# EAGLE design PIC18F66J60-1 (EAGLE 6.2)
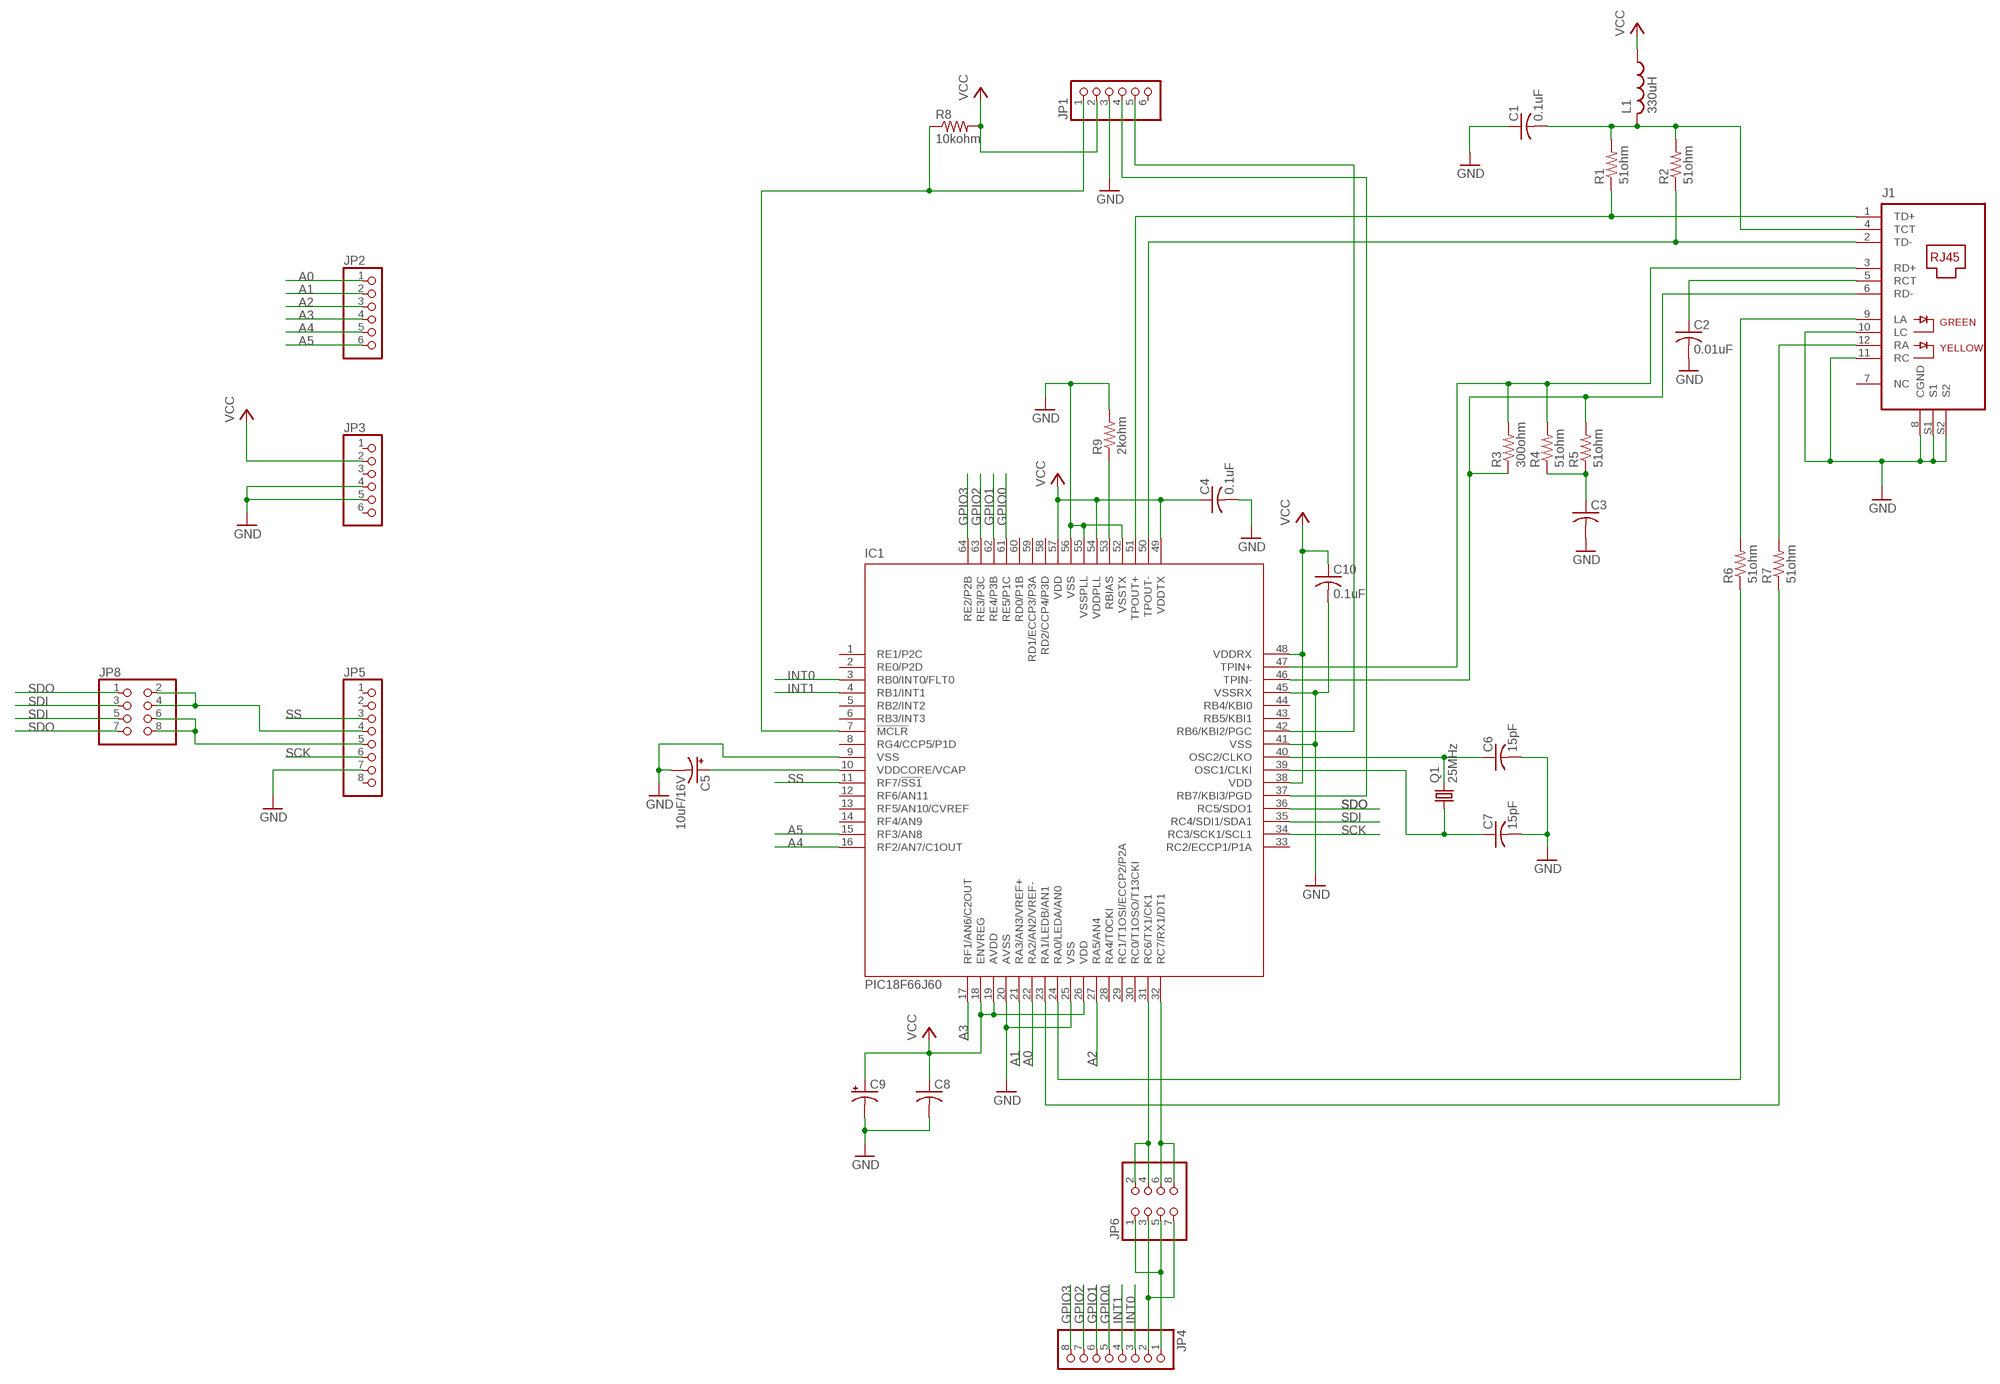
[diagram p0: schematic, sheet 1]

## Parts
C1  0.1uF  C-US025-040X050  [C025-040X050]
C2  0.01uF  C-US025-040X050  [C025-040X050]
C3  C-US025-040X050  [C025-040X050]
C4  0.1uF  C-US025-040X050  [C025-040X050]
C5  10uF/16V  CPOL-USE2.5-7  [E2,5-7]
C6  15pF  C-US025-040X050  [C025-040X050]
C7  15pF  C-US025-040X050  [C025-040X050]
C8  C-US025-040X050  [C025-040X050]
C9  CPOL-USE2.5-7  [E2,5-7]
C10  0.1uF  C-US025-040X050  [C025-040X050]
IC1  PIC18F66J60  [TQFP64-10X10]
J1  J0011  [PJ-J0]
JP1  PINHD-1X6  [1X06]
JP2  PINHD-1X6  [1X06]
JP3  PINHD-1X6  [1X06]
JP4  PINHD-1X8  [1X08]
JP5  PINHD-1X8  [1X08]
JP6  PINHD-2X4  [2X04]
JP8  PINHD-2X4  [2X04]
L1  330uH  L-US-01  [0204V]
Q1  25MHz  CRYSTALHC49S  [HC49/S]
R1  51ohm  R-US-01  [0204V]
R2  51ohm  R-US-01  [0204V]
R3  300ohm  R-US-01  [0204V]
R4  51ohm  R-US-01  [0204V]
R5  51ohm  R-US-01  [0204V]
R6  51ohm  R-US-01  [0204V]
R7  51ohm  R-US-01  [0204V]
R8  10kohm  R-US-01  [0204V]
R9  2kohm  R-US-01  [0204V]

## Nets
A0: IC1.22(RA2/AN2/VREF-) JP2.1
A1: IC1.21(RA3/AN3/VREF+) JP2.2
A2: IC1.27(RA5/AN4) JP2.3
A3: IC1.17(RF1/AN6/C2OUT) JP2.4
A4: IC1.16(RF2/AN7/C1OUT) JP2.5
A5: IC1.15(RF3/AN8) JP2.6
GND: C1.1 C2.2 C3.2 C4.2 C5.- C6.2 C7.2 C8.2 C9.- C10.2 IC1.9(VSS) IC1.20(AVSS) IC1.25(VSS) IC1.41(VSS) IC1.45(VSSRX) IC1.52(VSSTX) IC1.55(VSSPLL) IC1.56(VSS) J1.8(CGND) J1.10(LC) J1.11(RC) J1.S1 J1.S2 JP1.3 JP3.4 JP3.5 JP5.7 R9.2
GPIO0: IC1.61(RE5/P1C) JP4.5
GPIO1: IC1.62(RE4/P3B) JP4.6
GPIO2: IC1.63(RE3/P3C) JP4.7
GPIO3: IC1.64(RE2/P2B) JP4.8
INT0: IC1.3(RB0/INT0/FLT0) JP4.3
INT1: IC1.4(RB1/INT1) JP4.4
N$1: IC1.51(TPOUT+) J1.1(TD+) R1.1
N$2: IC1.50(TPOUT-) J1.2(TD-) R2.1
N$3: C1.2 J1.4(TCT) L1.2 R1.2 R2.2
N$4: IC1.47(TPIN+) J1.3(RD+) R3.2 R4.2
N$5: IC1.46(TPIN-) J1.6(RD-) R3.1 R5.2
N$6: C2.1 J1.5(RCT)
N$7: C3.1 R4.1 R5.1
N$8: J1.9(LA) R6.2
N$9: J1.12(RA) R7.2
N$10: IC1.37(RB7/KBI3/PGD) JP1.4
N$11: IC1.7(!MCLR) JP1.1 R8.1
N$12: IC1.24(RA0/LEDA/AN0) R6.1
N$13: IC1.23(RA1/LEDB/AN1) R7.1
N$14: IC1.42(RB6/KBI2/PGC) JP1.5
N$15: C6.1 IC1.40(OSC2/CLKO) Q1.2
N$16: C7.1 IC1.39(OSC1/CLKI) Q1.1
N$17: IC1.31(RC6/TX1/CK1) JP6.2 JP6.4
N$18: IC1.53(RBIAS) R9.1
N$19: C5.+ IC1.10(VDDCORE/VCAP)
N$20: IC1.32(RC7/RX1/DT1) JP6.6 JP6.8
N$21: JP5.5 JP8.6 JP8.8
N$22: JP4.2 JP6.3 JP6.7
N$23: JP4.1 JP6.1 JP6.5
N$25: JP5.4 JP8.2 JP8.4
SCK: IC1.34(RC3/SCK1/SCL1) JP5.6
SDI: IC1.35(RC4/SDI1/SDA1) JP8.3 JP8.5
SDO: IC1.36(RC5/SDO1) JP8.1 JP8.7
SS: IC1.11(RF7/!SS1) JP5.3
VCC: C4.1 C8.1 C9.+ C10.1 IC1.18(ENVREG) IC1.19(AVDD) IC1.26(VDD) IC1.38(VDD) IC1.48(VDDRX) IC1.49(VDDTX) IC1.54(VDDPLL) IC1.57(VDD) JP1.2 JP3.2 L1.1 R8.2
Unconnected: IC1.1(RE1/P2C) IC1.2(RE0/P2D) IC1.5(RB2/INT2) IC1.6(RB3/INT3) IC1.8(RG4/CCP5/P1D) IC1.12(RF6/AN11) IC1.13(RF5/AN10/CVREF) IC1.14(RF4/AN9) IC1.28(RA4/T0CKI) IC1.29(RC1/T1OSI/ECCP2/P2A) IC1.30(RC0/T1OSO/T13CKI) IC1.33(RC2/ECCP1/P1A) IC1.43(RB5/KBI1) IC1.44(RB4/KBI0) IC1.58(RD2/CCP4/P3D) IC1.59(RD1/ECCP3/P3A) IC1.60(RD0/P1B) J1.7(NC) JP1.6 JP3.1 JP3.3 JP3.6 JP5.1 JP5.2 JP5.8

## Library data of the parts
C1-C4 C6-C8 C10 = rcl:C-US: CAPACITOR, American symbol
C5 C9 = rcl:CPOL-US: POLARIZED CAPACITOR, American symbol
IC1 = microchip:PIC18F6*J6: PIC18F97J60 Family 64/80/100-Pin High-Performance, 1-Mbit Flash Microcontrollers with Ethernet Source: http://ww1.microchip.com/downloads/en/DeviceDoc/39762d.pdf; MPN: PIC18F66J60-I/PT; OC_FARNELL: 1332282; OC_NEWARK: 56K7296
J1 = pulse_j0011:J0011: RJ45 PulseJack w/LEDs
JP1-JP3 = pinhead:PINHD-1X6: PIN HEADER
JP4 JP5 = pinhead:PINHD-1X8: PIN HEADER
JP6 JP8 = pinhead:PINHD-2X4: PIN HEADER
L1 = kimai0827:L-US-01
Q1 = crystal:CRYSTAL: CRYSTAL; OC_FARNELL: 1667008; OC_NEWARK: unknown
R1-R9 = kimai0827:R-US-01

## Net classes
1 VCC: width 0.61 mm, drill 0.406 mm
2 GND: width 0.813 mm, drill 0.406 mm

## Board
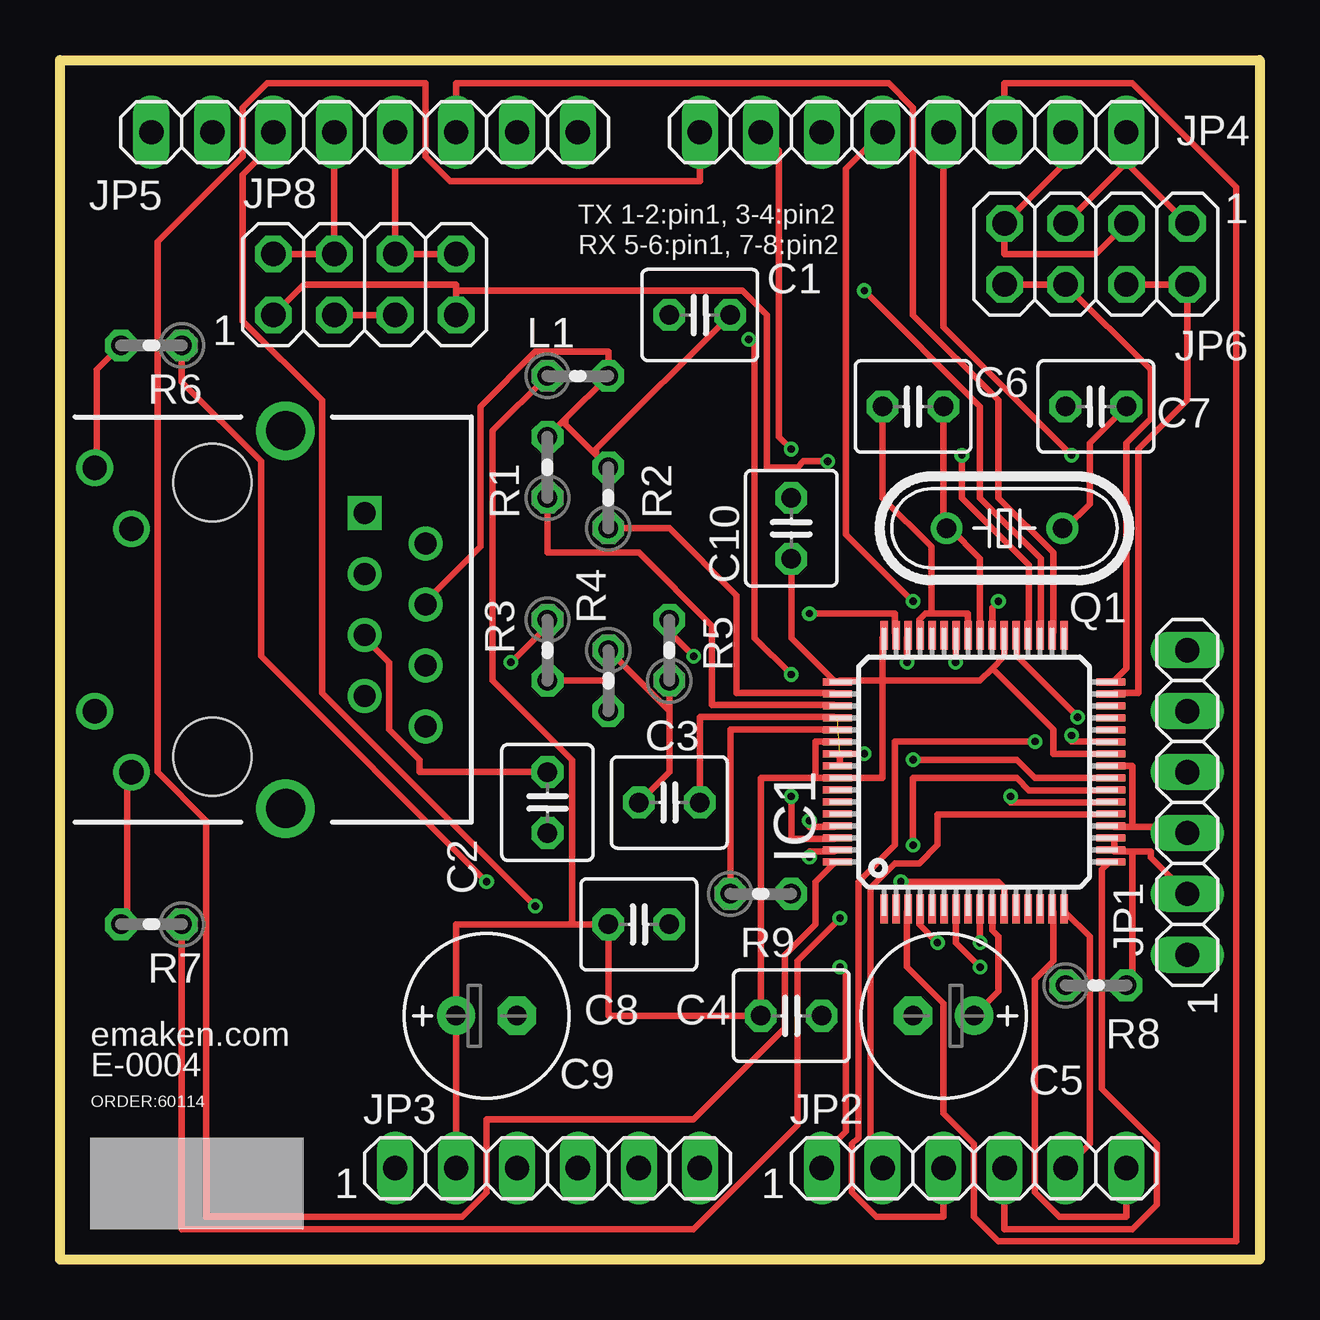
[diagram p1: board, top side]
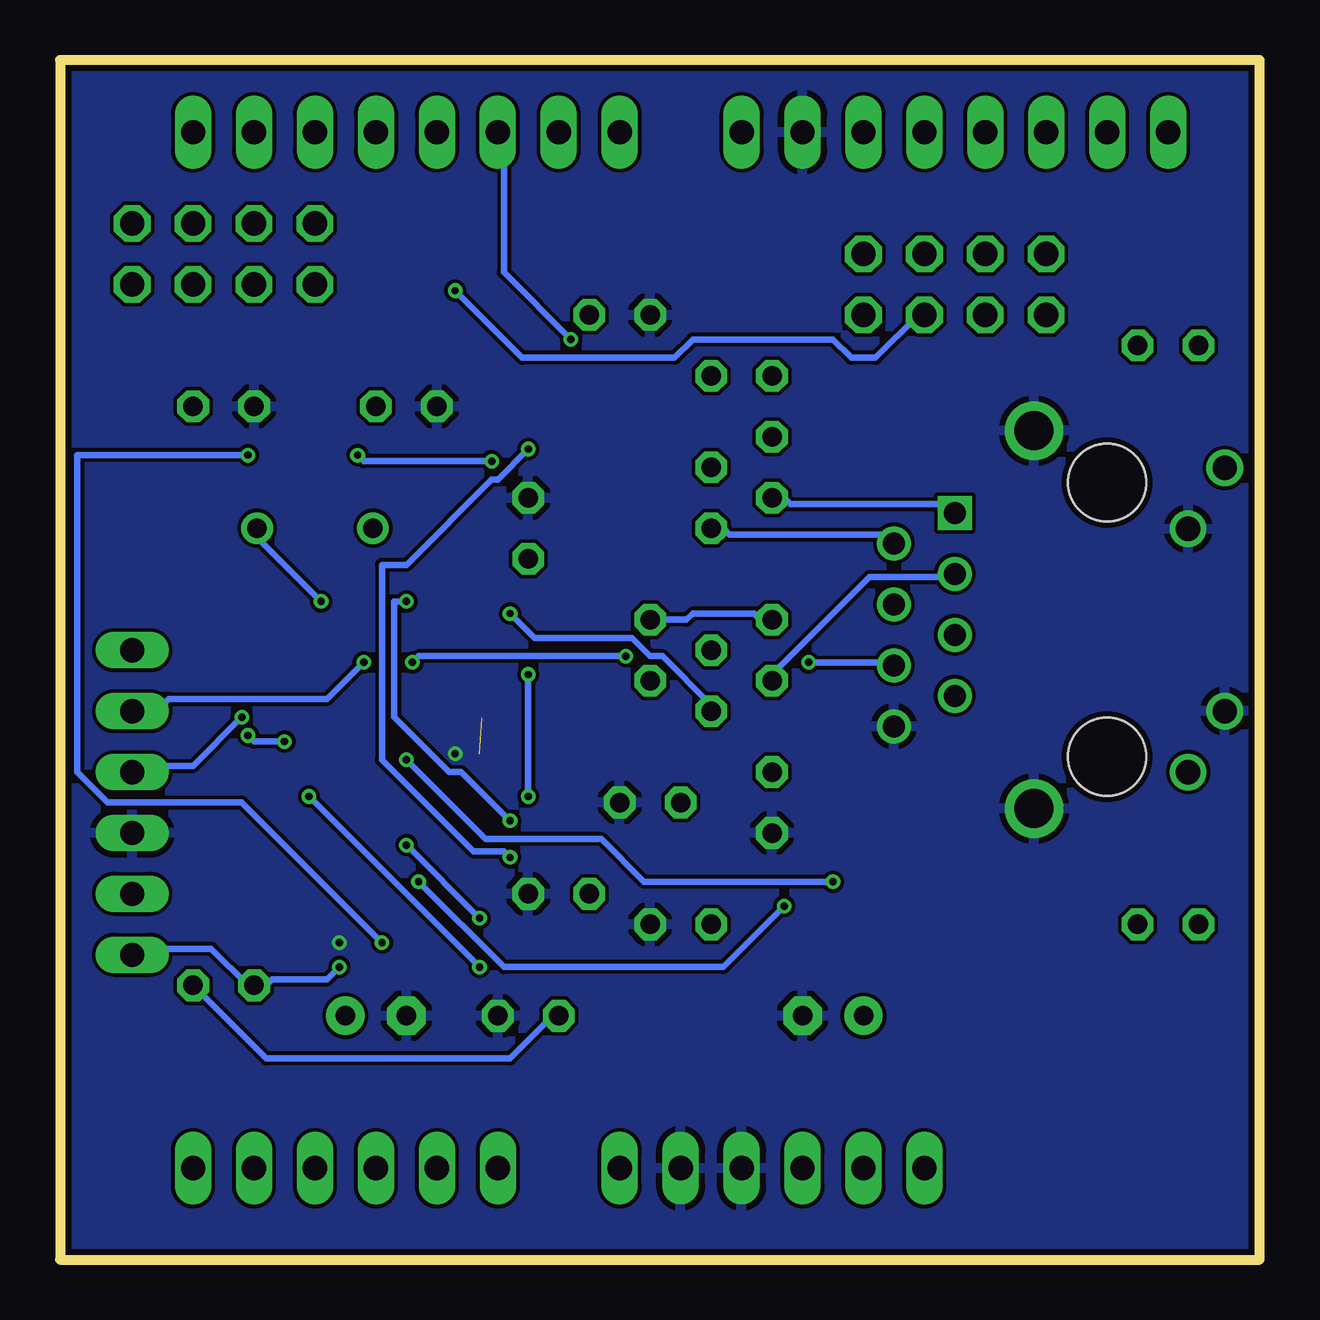
[diagram p2: board, bottom side, seen from below]

Size 50 x 50 mm. Coordinates in mm from the lower left corner, seen from the top.
Outline: 0,50 50,50 50,0 0,0 0,50
Copper layers (1*16): Top 0.035mm / dielectric 1.5mm / Bottom 0.035mm
Design rules: minimum track width 11mil, minimum drill 12mil, track to track 6mil, track to pad 6mil, pad to pad 6mil, via to via 6mil, smd to smd 0mil, copper to edge 10mil, drill to drill 10mil, minimum pad ring 10mil, minimum via ring 6mil, stop-mask expansion 2mil, vias tented up to drill 100mil, thermal gap 10mil

### Footprints (pad centres in the part's own frame; a part is rotated, then mirrored left to right if it is on the bottom)
C025-040X050 = drill 0.813 octagon: 1 -1.27,0; 2 1.27,0
E2,5-7 = drill 0.813 pad 1.6: + -1.27,0 | drill 0.813 pad 1.6 octagon: - 1.27,0
TQFP64-10X10 = smd 1.2 x 0.3: 1 -5.7,3.75; 2 -5.7,3.25; 3 -5.7,2.75; 4 -5.7,2.25; 5 -5.7,1.75; 6 -5.7,1.25; 7 -5.7,0.75; 8 -5.7,0.25; 9 -5.7,-0.25; 10 -5.7,-0.75; 11 -5.7,-1.25; 12 -5.7,-1.75; 13 -5.7,-2.25; 14 -5.7,-2.75; 15 -5.7,-3.25; 16 -5.7,-3.75; 33 5.7,-3.75; 34 5.7,-3.25; 35 5.7,-2.75; 36 5.7,-2.25; 37 5.7,-1.75; 38 5.7,-1.25; 39 5.7,-0.75; 40 5.7,-0.25; 41 5.7,0.25; 42 5.7,0.75; 43 5.7,1.25; 44 5.7,1.75; 45 5.7,2.25; 46 5.7,2.75; 47 5.7,3.25; 48 5.7,3.75 | smd 0.3 x 1.2: 17 -3.75,-5.7; 18 -3.25,-5.7; 19 -2.75,-5.7; 20 -2.25,-5.7; 21 -1.75,-5.7; 22 -1.25,-5.7; 23 -0.75,-5.7; 24 -0.25,-5.7; 25 0.25,-5.7; 26 0.75,-5.7; 27 1.25,-5.7; 28 1.75,-5.7; 29 2.25,-5.7; 30 2.75,-5.7; 31 3.25,-5.7; 32 3.75,-5.7; 49 3.75,5.7; 50 3.25,5.7; 51 2.75,5.7; 52 2.25,5.7; 53 1.75,5.7; 54 1.25,5.7; 55 0.75,5.7; 56 0.25,5.7; 57 -0.25,5.7; 58 -0.75,5.7; 59 -1.25,5.7; 60 -1.75,5.7; 61 -2.25,5.7; 62 -2.75,5.7; 63 -3.25,5.7; 64 -3.75,5.7
PJ-J0 = drill 0.914 square: 1 4.445,-6.35 | drill 0.914: 2 3.175,-8.89; 3 1.905,-6.35; 4 0.635,-8.89; 5 -0.635,-6.35; 6 -1.905,-8.89; 7 -3.175,-6.35; 8 -4.445,-8.89 | drill 1.016: 9 6.325,4.902; 10 3.785,3.378; 11 -3.81,4.902; 12 -6.35,3.378 | drill 1.626: S1 -7.874,-3.048; S2 7.874,-3.048 | hole 3.251: -5.715,0; 5.715,0
1X06 = drill 1.016 long: 1 -6.35,0; 2 -3.81,0; 3 -1.27,0; 4 1.27,0; 5 3.81,0; 6 6.35,0
1X08 = drill 1.016 long: 1 -8.89,0; 2 -6.35,0; 3 -3.81,0; 4 -1.27,0; 5 1.27,0; 6 3.81,0; 7 6.35,0; 8 8.89,0
2X04 = drill 1.016 octagon: 1 -3.81,-1.27; 2 -3.81,1.27; 3 -1.27,-1.27; 4 -1.27,1.27; 5 1.27,-1.27; 6 1.27,1.27; 7 3.81,-1.27; 8 3.81,1.27
0204V = drill 0.813 octagon: 1 0,0; 2 2.54,0
HC49/S = drill 0.813: 1 -2.413,0; 2 2.413,0

### Placement (x,y rotation side)
C1  26.67,39.37 0 top
C2  20.32,19.05 270 top
C3  25.4,19.05 0 top
C4  30.48,10.16 0 top
C5  36.83,10.16 180 top
C6  35.56,35.56 180 top
C7  43.18,35.56 180 top
C8  24.13,13.97 0 top
C9  17.78,10.16 0 top
C10  30.48,30.48 90 top
IC1  38.1,20.32 90 top
J1  6.35,26.67 90 top
JP1  46.99,19.05 90 top
JP2  38.1,3.81 0 top
JP3  20.32,3.81 0 top
JP4  35.56,46.99 180 top
JP5  12.7,46.99 0 top
JP6  43.18,41.91 180 top
JP8  12.7,40.64 0 top
L1  20.32,36.83 0 top
Q1  39.37,30.48 180 top
R1  20.32,31.75 90 top
R2  22.86,30.48 90 top
R3  20.32,26.67 270 top
R4  22.86,25.4 270 top
R5  25.4,24.13 90 top
R6  5.08,38.1 180 top
R7  5.08,13.97 180 top
R8  41.91,11.43 0 top
R9  27.94,15.24 0 top

### Tracks (layer width: path | path; a pad name or v marks a point on that pad's centre or on a via)
A0  (via drill 0.3)
  Top 0.279: v39.62,19.3 39.62,19.05 43.69,19.05 IC1.22 | v32.51,12.19 32.77,11.94 32.77,5.33 31.75,4.32 JP2.1
  Bottom 0.279: v32.51,12.19 v39.62,19.3
A1
  Top 0.279: JP2.2 33.78,4.32 33.78,15.49 34.8,16.51 35.81,16.51 36.58,17.27 36.58,18.54 43.69,18.54 IC1.21
A2  (via drill 0.3)
  Top 0.279: v42.16,21.84 42.16,21.59 43.69,21.59 IC1.27 | v40.64,21.59 34.8,21.59 34.8,17.27 33.27,15.75 33.27,5.08 33.02,4.83 33.02,2.79 34.04,1.78 36.83,1.78 JP2.3
  Bottom 0.279: v42.16,21.84 41.91,21.59 v40.64,21.59
A3
  Top 0.279: JP2.4 39.37,1.27 44.7,1.27 45.72,2.29 45.72,4.83 43.43,7.11 43.43,16.26 43.69,16.51 IC1.17
A4
  Top 0.279: JP2.5 42.93,4.83 42.93,13.46 41.91,14.48 IC1.16
A5
  Top 0.279: JP2.6 44.45,1.78 41.66,1.78 40.64,2.79 40.64,11.68 41.4,12.45 41.4,14.48 IC1.15
GND  (via drill 0.3)  (1 unrouted)
  Top 0.279: 36.32,26.92 37.85,26.92 37.85,26.16 IC1.41 | 36.32,26.92 36.07,26.92 35.81,26.67 35.81,26.16 IC1.45 | 32.51,21.08 32.51,20.57 IC1.56 | v38.35,13.21 38.35,14.48 IC1.9 | 44.7,18.03 46.99,18.03 JP1.3 | 44.7,18.03 43.94,18.03 IC1.20 | 44.7,18.03 44.7,20.57 43.94,20.57 IC1.25 | C3.2 26.67,22.61 32.26,22.61 IC1.52 | v33.53,21.08 32.51,21.08 | 32.51,21.08 IC1.55 | 36.32,26.92 36.32,29.72 34.29,31.75 C6.2
  pour Bottom: -1.27,50.8 50.8,50.8 50.8,-1.27 -1.27,-1.27
GPIO0  (via drill 0.3)
  Top 0.279: v31.24,18.29 31.24,18.03 32.26,18.03 IC1.61 | v35.56,27.43 32.77,30.23 32.77,45.47 JP4.5
  Bottom 0.279: v31.24,18.29 33.27,20.32 33.78,20.32 36.07,22.61 36.07,27.43 v35.56,27.43
GPIO1  (via drill 0.3)
  Top 0.279: v30.48,19.3 30.48,17.53 32.26,17.53 IC1.62 | v30.48,24.38 28.96,25.91 28.96,38.1 v28.7,38.35
  Bottom 0.279: v30.48,24.38 v30.48,19.3 | v28.7,38.35 31.5,41.15 31.5,46.99 JP4.6
GPIO2  (via drill 0.3)
  Top 0.279: v31.24,16.76 31.24,17.02 32.26,17.02 IC1.63 | v30.48,33.78 29.97,34.29 29.97,46.23 JP4.7
  Bottom 0.279: v31.24,16.76 31.5,17.02 32.77,17.02 36.58,20.83 36.58,28.96 35.56,28.96 32,32.51 31.75,32.51 v30.48,33.78
GPIO3
  Top 0.279: JP4.8 26.67,44.96 16.26,44.96 15.24,45.97 15.24,49.02 8.64,49.02 7.62,48.01 7.62,45.97 4.06,42.42 4.06,20.32 6.1,18.29 6.1,1.78 16.76,1.78 17.78,2.79 17.78,5.84 26.42,5.84 30.23,9.65 30.23,12.7 31.5,13.97 31.5,15.75 32.26,16.51 IC1.64
INT0
  Top 0.279: JP4.3 39.37,49.02 44.7,49.02 49.02,44.7 49.02,0.76 39.12,0.76 38.1,1.78 38.1,4.83 36.83,6.1 36.83,10.67 35.31,12.19 35.31,14.48 IC1.3
INT1  (via drill 0.3)
  Top 0.279: v36.58,13.21 35.81,13.97 35.81,14.48 IC1.4 | v42.16,33.53 36.83,38.86 JP4.4
  Bottom 0.279: v36.58,13.21 42.42,19.05 48.01,19.05 49.28,20.32 49.28,33.53 v42.16,33.53
N$1
  Top 0.279: R1.1 20.32,29.46 24.13,29.46 27.18,26.42 27.18,23.11 32.26,23.11 IC1.51
  Bottom 0.279: R1.1 19.81,31.75 19.56,31.5 12.95,31.5 12.7,31.24 J1.1
N$2
  Top 0.279: R2.1 25.4,30.48 28.19,27.69 28.19,23.62 32.26,23.62 IC1.50
  Bottom 0.279: R2.1 22.35,30.48 22.1,30.23 15.49,30.23 15.24,29.97 J1.2
N$3
  Top 0.279: 21.08,35.05 L1.2 22.86,37.85 19.81,37.85 17.53,35.56 17.53,29.72 15.24,27.43 J1.4 | 21.08,35.05 R1.2 | 22.35,33.53 21.08,34.8 21.08,35.05 | 22.35,33.53 R2.2 | C1.2 22.35,33.78 22.35,33.53
N$4  (via drill 0.3)
  Top 0.279: v31.24,26.92 34.8,26.92 34.8,26.16 IC1.47 | R3.2 22.86,24.13 R4.2
  Bottom 0.279: v31.24,26.92 30.23,25.91 26.16,25.91 25.4,25.15 24.89,25.15 22.86,23.11 R4.2 | R3.2 20.32,24.38 16.26,28.45 12.7,28.45 J1.3
N$5  (via drill 0.3)
  Top 0.279: v35.31,24.89 35.31,25.91 IC1.46 | v26.42,25.15 25.4,26.16 R5.2 | v18.8,24.89 20.32,26.42 R3.1
  Bottom 0.279: R5.2 23.88,26.67 23.62,26.92 21.08,26.92 20.83,26.67 R3.1 | v35.31,24.89 35.05,25.15 v26.42,25.15 | v18.8,24.89 15.24,24.89 J1.6
N$6
  Top 0.279: C2.1 14.99,20.32 14.99,20.83 13.72,22.1 13.72,24.89 12.7,25.91 J1.5
N$7
  Top 0.279: C3.1 25.4,20.32 25.4,22.86 | R5.1 25.4,22.86 | 25.4,22.86 R4.1
N$8
  Top 0.279: R6.2 1.52,37.08 1.52,33.02 J1.9
N$9
  Top 0.279: R7.2 2.79,14.22 2.79,20.32 J1.12
N$10  (via drill 0.3)
  Top 0.279: v42.42,22.61 39.88,25.15 39.88,25.91 IC1.37
  Bottom 0.279: v42.42,22.61 44.45,20.57 46.74,20.57 JP1.4
N$11  (via drill 0.3)
  Top 0.279: v38.35,12.19 37.34,13.21 37.34,14.48 IC1.7
  Bottom 0.279: v38.35,12.19 38.86,11.68 41.15,11.68 41.4,11.43 R8.1 42.16,11.43 43.69,12.95 46.74,12.95 JP1.1
N$12  (via drill 0.3)
  Top 0.279: v35.56,20.83 39.88,20.83 40.64,20.07 43.69,20.07 IC1.24 | v17.78,15.75 8.38,25.15 8.38,33.27 5.08,36.58 R6.1
  Bottom 0.279: v35.56,20.83 32.26,17.53 27.43,17.53 25.65,15.75 v17.78,15.75
N$13  (via drill 0.3)
  Top 0.279: v35.56,17.27 35.56,20.07 39.88,20.07 40.39,19.56 43.69,19.56 IC1.23 | v32.51,14.22 30.73,12.45 30.73,5.59 26.42,1.27 5.08,1.27 R7.1
  Bottom 0.279: v32.51,14.22 v35.56,17.27
N$14  (via drill 0.3)
  Top 0.279: v37.34,24.89 37.34,25.91 IC1.42
  Bottom 0.279: v37.34,24.89 38.86,23.37 45.47,23.37 45.97,22.86 JP1.5
N$15
  Top 0.279: IC1.40 38.35,26.16 38.35,29.21 37.08,30.48 Q1.2 36.83,30.48 C6.1
N$16  (via drill 0.3)
  Top 0.279: v39.12,27.43 38.86,27.18 38.86,26.16 IC1.39 | C7.1 42.93,34.04 42.93,31.5 41.91,30.48 Q1.1
  Bottom 0.279: v39.12,27.43 41.66,29.97 41.66,30.48 Q1.1
N$17
  Top 0.279: IC1.31 43.94,23.62 44.96,23.62 44.96,33.78 46.99,35.81 JP6.2 JP6.4
N$18
  Top 0.279: R9.1 27.94,22.1 32.26,22.1 IC1.53
N$19
  Top 0.279: C5.+ 39.12,11.18 39.12,13.46 38.86,13.72 38.86,14.48 IC1.10
N$20
  Top 0.279: IC1.32 43.94,24.13 44.45,24.64 44.45,34.04 45.47,35.05 45.47,37.08 JP6.6 JP6.8
N$21
  Top 0.279: JP8.8 JP8.6 JP5.5
N$22
  Top 0.279: JP4.2 41.91,45.72 JP6.7 39.37,41.91 43.18,41.91 JP6.3
N$23
  Top 0.279: 44.45,45.72 JP6.5 | 44.45,45.72 JP6.1 | 44.45,45.72 JP4.1
N$25
  Top 0.279: JP8.2 JP8.4 JP5.4
SCK
  Top 0.279: JP5.6 16.51,49.02 34.54,49.02 35.56,48.01 35.56,39.37 39.12,35.81 39.12,31.75 41.4,29.46 41.4,26.16 IC1.34
SDI  (via drill 0.3)
  Top 0.279: v33.53,40.39 38.35,35.56 38.35,31.75 40.89,29.21 40.89,26.16 IC1.35 | JP8.5 JP8.3
  Bottom 0.279: v33.53,40.39 30.73,37.59 24.38,37.59 23.62,38.35 17.78,38.35 17.02,37.59 16,37.59 14.22,39.37 JP8.5
SDO  (via drill 0.3)
  Top 0.279: v37.59,33.53 37.59,31.75 40.39,28.96 40.39,26.16 IC1.36 | v32,33.27 30.99,33.27 30.73,33.02 29.46,33.02 29.46,39.37 28.45,40.39 16.51,40.39 | JP8.7 16.51,40.39 | JP8.1 10.16,40.64 16.51,40.64 16.51,40.39
  Bottom 0.279: v37.59,33.53 37.34,33.27 v32,33.27
SS  (via drill 0.3)
  Top 0.279: v35.05,15.75 39.12,15.75 39.37,15.49 39.37,14.73 IC1.11 | v19.81,14.73 10.92,23.62 10.92,35.81 7.62,39.12 7.62,45.21 8.89,46.48 JP5.3
  Bottom 0.279: v35.05,15.75 31.5,12.19 22.35,12.19 v19.81,14.73
VCC
  Top 0.279: 34.29,24.13 34.29,25.91 IC1.48 | 34.29,24.13 34.29,20.07 32.51,20.07 IC1.57 32.26,20.07 31.5,20.07 | 31.5,20.07 31.5,21.59 32.26,21.59 IC1.54 | 34.29,24.13 32.51,24.13 IC1.49 32.26,24.13 30.48,25.91 C10.1 | 38.86,24.64 38.35,24.13 34.29,24.13 | 38.86,24.64 39.37,25.15 39.37,25.91 IC1.38 | 38.86,24.64 41.4,22.1 41.4,21.08 43.69,21.08 IC1.26 | 43.94,17.02 43.94,17.53 IC1.19 | 44.7,17.02 45.47,17.02 45.47,16.76 JP1.2 | 44.7,17.02 43.94,17.02 | 43.94,17.02 IC1.18 | R8.2 44.7,11.68 44.7,17.02 | 21.34,13.97 16.51,13.97 C9.+ JP3.2 | 21.34,13.97 C8.1 22.86,10.16 C4.1 29.21,20.07 31.5,20.07 | L1.1 18.03,34.54 18.03,24.13 21.34,20.83 21.34,13.97
  Bottom 0.279: R8.2 41.4,8.38 31.24,8.38 29.46,10.16 C4.1

### Text on the board
tPlace: TX 1-2:pin1, 3-4:pin2 | RX 5-6:pin1, 7-8:pin2 | emaken.com | E-0004 | ORDER:60114